# EAGLE design LEDController (EAGLE 7.1.0)
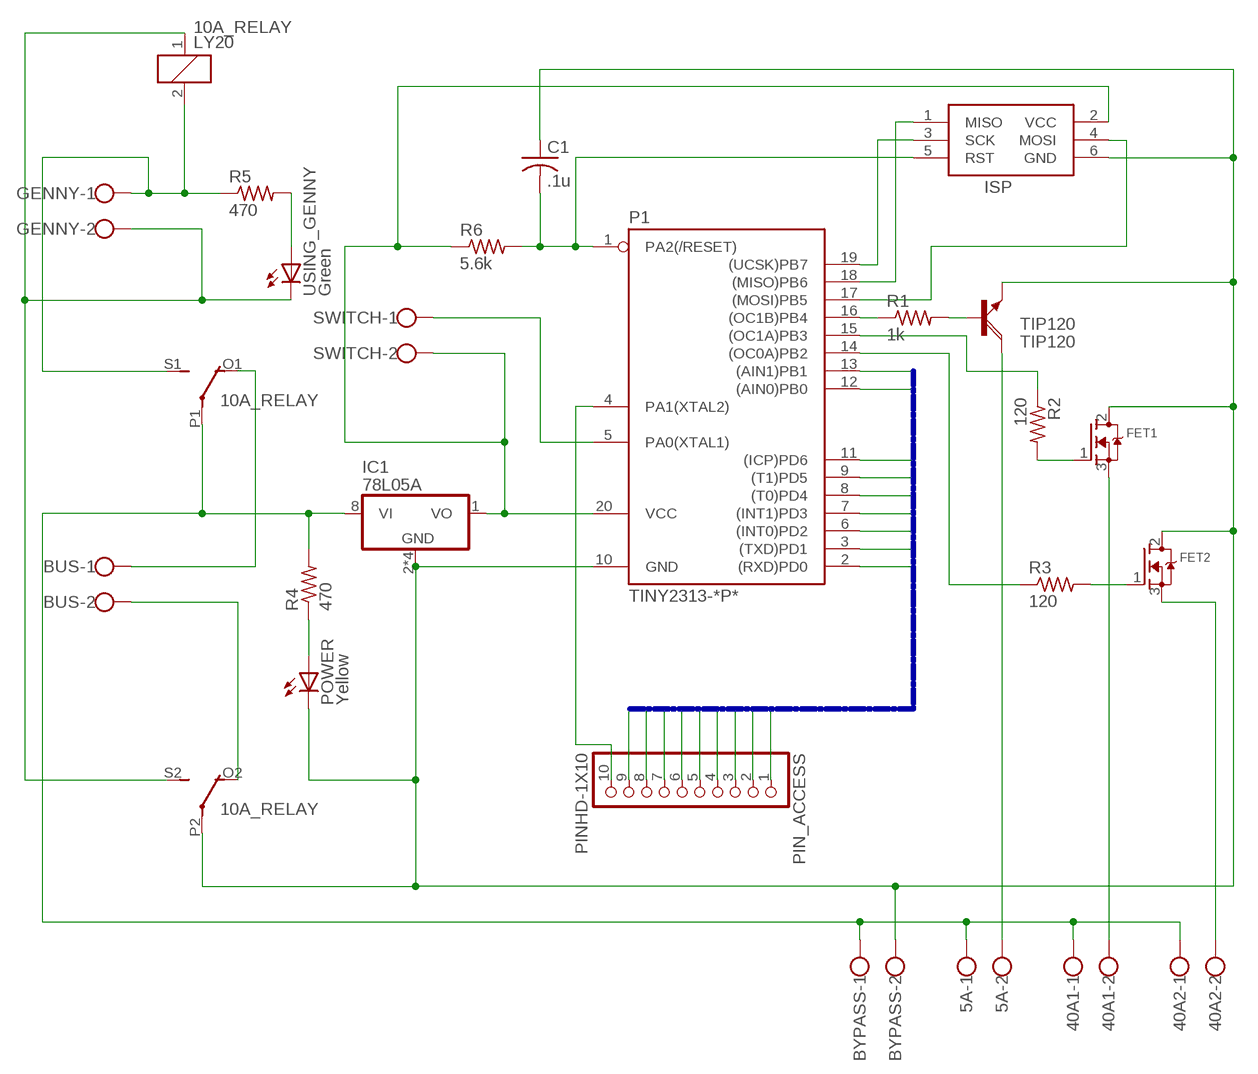
[diagram p0: schematic, sheet 1]

## Parts
5A  W237-102  [W237-102]
10A_RELAY  LY20  [LY20]
40A1  W237-102  [W237-102]
40A2  W237-102  [W237-102]
BUS  W237-102  [W237-102]
BYPASS  W237-102  [W237-102]
C1  .1u  C-US025-030X050  [C025-030X050]
FET1  MOSFET-NGDS_TO220V  [TO220V]
FET2  MOSFET-NGDS_TO220V  [TO220V]
GENNY  W237-102  [W237-102]
IC1  78L05A  [SOIC8]
ISP  AVRISP-6  [AVRISP]
P1  TINY2313-*P*  [DIL20]
PIN_ACCESS  PINHD-1X10  [1X10-BIG]
POWER  Yellow  LED5MM  [LED5MM]
R1  1k  R-US_0204/7  [0204/7]
R2  120  R-US_0204/7  [0204/7]
R3  120  R-US_0204/7  [0204/7]
R4  470  R-US_0204/7  [0204/7]
R5  470  R-US_0204/7  [0204/7]
R6  5.6k  R-US_0204/7  [0204/7]
SWITCH  W237-102  [W237-102]
TIP120  TIP120  [TO220AH]
USING_GENNY  Green  LED5MM  [LED5MM]

## Nets
10A_RELAY: 10A_RELAY.1 10A_RELAY.S2(3:S) GENNY.2 USING_GENNY.K(C)
GND: 10A_RELAY.P2(3:P) BYPASS.2 C1.1 FET1.2(D) FET2.2(D) IC1.2(GND) IC1.3(GND) IC1.6(GND) IC1.7(GND) ISP.6(GND) P1.10(GND) POWER.K(C) TIP120.E
N$1: ISP.1(MISO) P1.18((MISO)PB6)
N$2: P1.5(PA0(XTAL1)) SWITCH.1
N$3: P1.16((OC1B)PB4) R1.1
N$4: R1.2 TIP120.B
N$5: P1.15((OC1A)PB3) R2.1
N$6: FET1.1(G) R2.2
N$7: P1.14((OC0A)PB2) R3.1
N$8: FET2.1(G) R3.2
N$9: 5A.1 10A_RELAY.P1(2:P) 40A1.1 40A2.1 BYPASS.1 IC1.8(VI) R4.2
N$10: POWER.A R4.1
N$11: ISP.4(MOSI) P1.17((MOSI)PB5)
N$12: 10A_RELAY.2 10A_RELAY.S1(2:S) GENNY.1 R5.1
N$13: R5.2 USING_GENNY.A
N$15: 10A_RELAY.O1(2:O) BUS.1
N$16: 40A1.2 FET1.3(S)
N$17: 10A_RELAY.O2(3:O) BUS.2
N$18: 5A.2 TIP120.C
N$19: C1.2 ISP.5(RST) P1.1(PA2(/RESET)) R6.2
N$21: 40A2.2 FET2.3(S)
N$22: ISP.3(SCK) P1.19((UCSK)PB7)
N$23: P1.4(PA1(XTAL2)) PIN_ACCESS.10
PIN1: P1.2((RXD)PD0) PIN_ACCESS.1
PIN2: P1.3((TXD)PD1) PIN_ACCESS.2
PIN3: P1.12((AIN0)PB0) PIN_ACCESS.3
PIN4: P1.13((AIN1)PB1) PIN_ACCESS.4
PIN5: P1.6((INT0)PD2) PIN_ACCESS.5
PIN6: P1.7((INT1)PD3) PIN_ACCESS.6
PIN7: P1.8((T0)PD4) PIN_ACCESS.7
PIN8: P1.9((T1)PD5) PIN_ACCESS.8
PIN9: P1.11((ICP)PD6) PIN_ACCESS.9
VCC: IC1.1(VO) ISP.2(VCC) P1.20(VCC) R6.1 SWITCH.2

## Buses
PIN[1..9]

## Library data of the parts
5A 40A1 40A2 BUS BYPASS GENNY SWITCH = con-wago-500:W237-102: WAGO SCREW CLAMP; MPN: 237-102; OC_FARNELL: unknown; OC_NEWARK: 70K9898
10A_RELAY = relay:LY20: RELAY 2 x switch, Omron; OC_FARNELL: unknown; OC_NEWARK: unknown
C1 = adafruit:C-US: CAPACITOR, American symbol
FET1 FET2 = adafruit:MOSFET-N: N-Channel Mosfet 2N7002E - 60V 260mA SOT23 [Digikey: 2N7002ET1GOSTR-ND] - REEL BSH103 - 30V 850mA SOT23 [Digikey: 568-5013-1-ND]
IC1 = gm-regulators:78*: Positive VOLTAGE REGULATOR Source: http://cache.national.com/ds/LM/LM78L05.pdf http://www.fairchildsemi.com/ds/LM/LM7805.pdf
ISP = adafruit:AVRISP: AVR ISP HEADER Standard 6 pin header for AVR programming
P1 = avr-6:TINY2313*: Atmel Tiny2313 2K Flash, 128 bytes EEPROM, 128 bytes RAM
PIN_ACCESS = adafruit:PINHD-1X10: Pin header 1x10 0.1" spacing With round pins
POWER USING_GENNY = adafruit:LED: LED OSRAM: - CHIPLED LG R971, LG N971, LY N971, LG Q971, LY Q971, LO R971, LY R971 LH N974, LH R974 LS Q976, LO Q976, LY Q976 LO Q996 - Hyper CHIPLED LW Q18S LB Q993, LB Q99A, LB R99A - SideLED LS A670, LO A670, LY A670, LG A670, LP A670 LB A673, LV A673, LT A673, LW A673 LH A674 LY A675 LS A676, LA A676, LO A676, LY A676, LW A676 LS A679, LY A679, LG A679 - Hyper Micro SIDELED® LS Y876, LA Y876, LO Y876, LY Y876 LT Y87S - SmartLED LW L88C, LW L88S LB L89C, LB L89S, LG L890 LS L89K, LO L89K, LY L89K LS L896, LA L896, LO L896, LY L896 - TOPLED LS T670, LO T670, LY T670, LG T670, LP T670 LSG T670, LSP T670, LSY T670, LOP T670, LYG T670 LG T671, LOG T671, LSG T671 LB T673, LV T673, LT T673, LW T673 LH T674 LS T676, LA T676, LO T676, LY T676, LB T676, LH T676, LSB T676, LW T676 LB T67C, LV T67C, LT T67C, LS T67K, LO T67K, LY T67K, LW E67C LS E67B, LA E67B, LO E67B, LY E67B, LB E67C, LV E67C, LT E67C LW T67C LS T679, LY T679, LG T679 LS T770, LO T770, LY T770, LG T770, LP T770 LB T773, LV T773, LT T773, LW T773 LH T774 LS E675, LA E675, LY E675, LS T675 LS T776, LA T776, LO T776, LY T776, LB T776 LHGB T686 LT T68C, LB T68C - Hyper Mini TOPLED® LB M676 - Mini TOPLED Santana® LG M470 LS M47K, LO M47K, LY M47K Source: http://www.osram.convergy.de/
R1-R6 = adafruit:R-US_: RESISTOR, American symbol
TIP120 = transistor-power:TIP120: NPN DARLINGTON TRANSISTOR

## Board
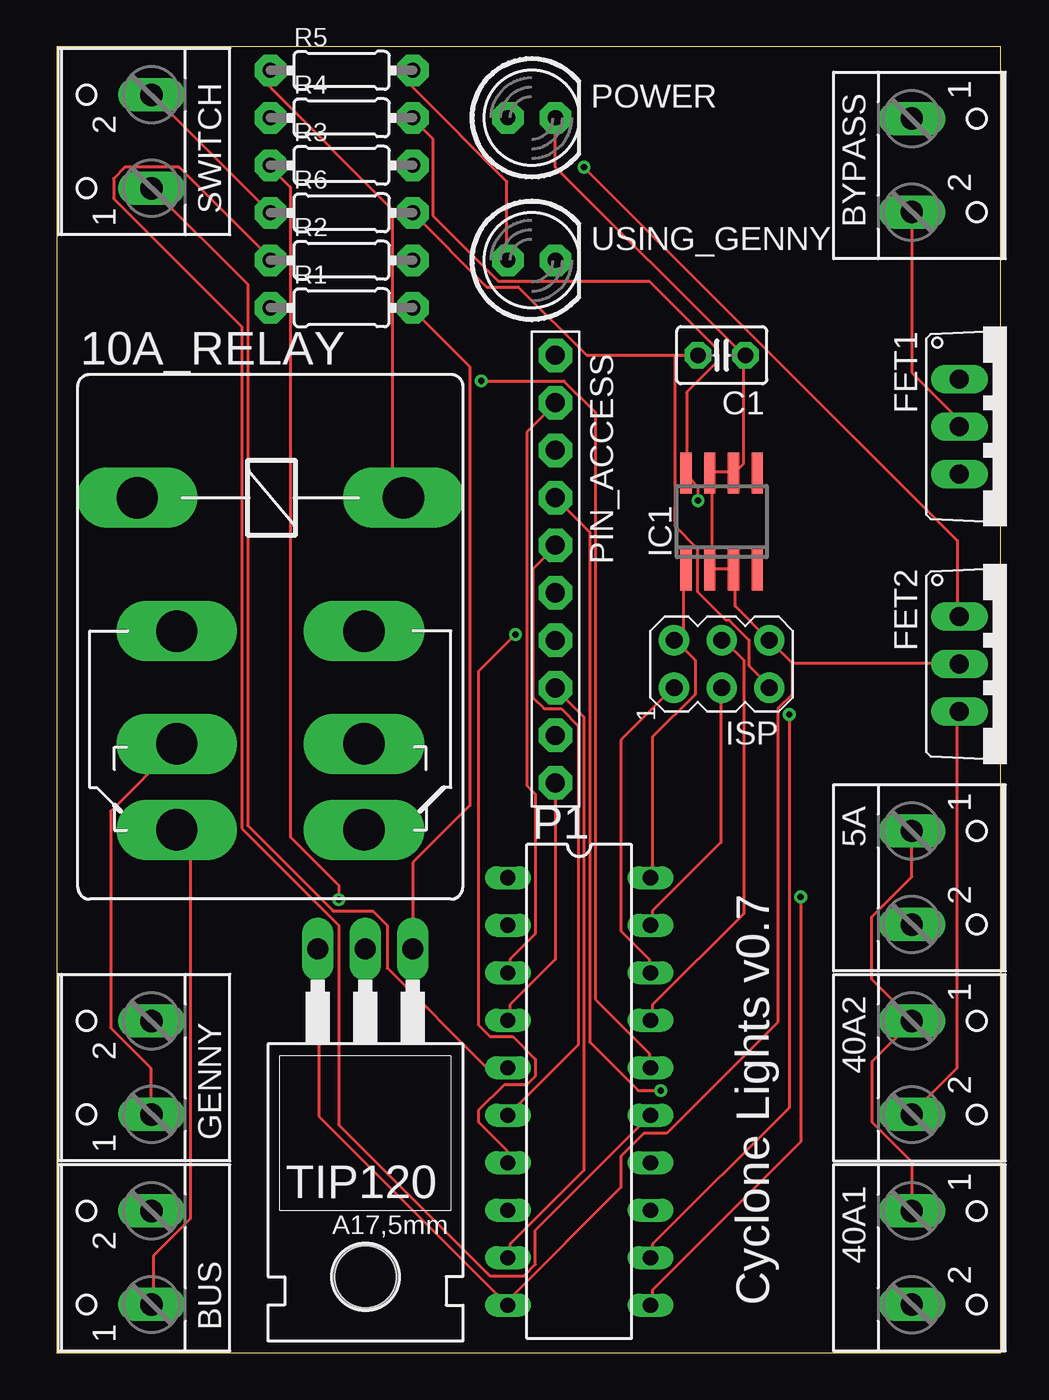
[diagram p1: board, top side]
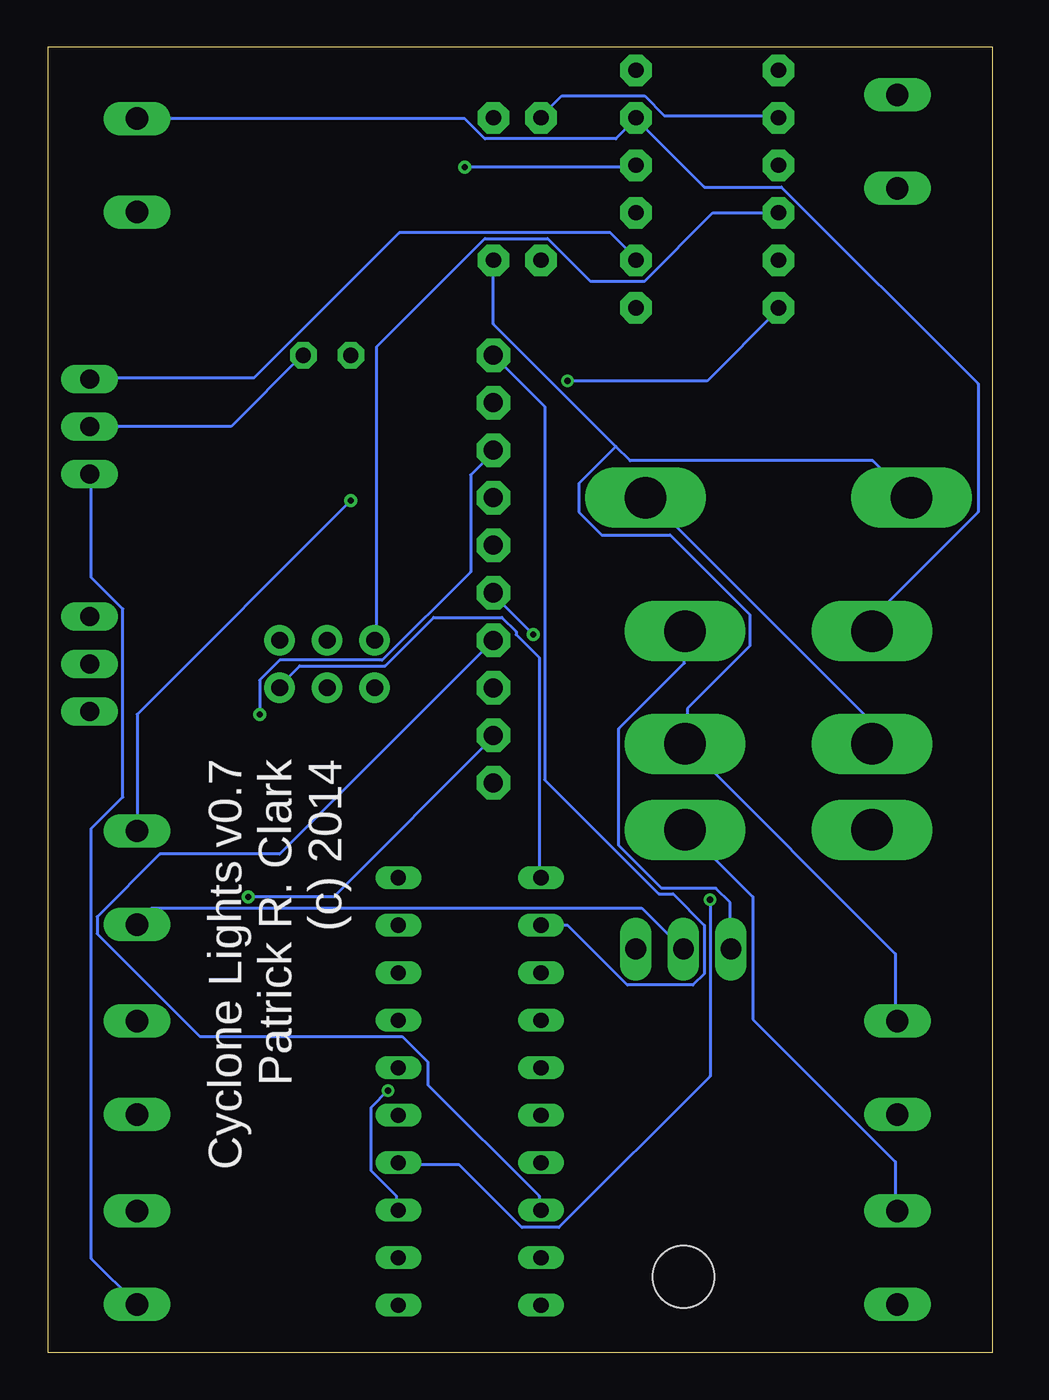
[diagram p2: board, bottom side, seen from below]

Size 50.47 x 69.84 mm. Coordinates in mm from the lower left corner, seen from the top.
Outline: 0,0 50.47,0 50.47,69.84 0,69.84 0,0
Copper layers (1*16): Top 0.0356mm / dielectric 1.5011mm / Bottom 0.0356mm
Design rules "LaenPCBOrder": minimum track width 6mil, minimum drill 13mil, track to track 6mil, track to pad 6mil, pad to pad 6mil, via to via 6mil, smd to smd 6mil, copper to edge 15mil, drill to drill 6mil, minimum pad ring 7mil, minimum via ring 7mil, stop-mask expansion 3mil, vias tented up to drill 0mil, thermal gap 10mil

### Footprints (pad centres in the part's own frame; a part is rotated, then mirrored left to right if it is on the bottom)
W237-102 = drill 1.194 long: 1 -2.5,-1.27; 2 2.5,-1.27
LY20 = drill 2.21 long: 1 -7.112,0; 2 7.112,0; O1 -5.004,-17.755; O2 5.004,-17.755; P1 -5.004,-7.137; P2 5.004,-7.137; S1 -5.004,-13.157; S2 5.004,-13.157
C025-030X050 = drill 0.813 pad 1.422 octagon: 1 -1.27,0; 2 1.27,0
TO220V = drill 1.016 long: 1 -2.54,-2.54; 2 0,-2.54; 3 2.54,-2.54
SOIC8 = smd 0.6 x 2.2: 1 -1.905,-2.6; 2 -0.635,-2.6; 3 0.635,-2.6; 4 1.905,-2.6; 5 1.905,2.6; 6 0.635,2.6; 7 -0.635,2.6; 8 -1.905,2.6
AVRISP = drill 0.9 pad 1.626: 1 -1.27,2.54; 2 1.27,2.54; 3 -1.27,0; 4 1.27,0; 5 -1.27,-2.54; 6 1.27,-2.54
DIL20 = drill 0.813 long: 1 -11.43,-3.81; 2 -8.89,-3.81; 3 -6.35,-3.81; 4 -3.81,-3.81; 5 -1.27,-3.81; 6 1.27,-3.81; 7 3.81,-3.81; 8 6.35,-3.81; 9 8.89,-3.81; 10 11.43,-3.81; 11 11.43,3.81; 12 8.89,3.81; 13 6.35,3.81; 14 3.81,3.81; 15 1.27,3.81; 16 -1.27,3.81; 17 -3.81,3.81; 18 -6.35,3.81; 19 -8.89,3.81; 20 -11.43,3.81
1X10-BIG = drill 1.016 pad 1.778 octagon: 1 -11.43,0; 2 -8.89,0; 3 -6.35,0; 4 -3.81,0; 5 -1.27,0; 6 1.27,0; 7 3.81,0; 8 6.35,0; 9 8.89,0; 10 11.43,0
LED5MM = drill 0.813 pad 1.676 octagon: A -1.27,0; K 1.27,0
0204/7 = drill 0.813 pad 1.676 octagon: 1 -3.81,0; 2 3.81,0
TO220AH = drill 1.118 long: B -2.54,-6.35; C 0,-6.35; E 2.54,-6.35 | hole 3.302: 0,11.176

### Placement (x,y rotation side)
5A  46.99,25.4 270 top
10A_RELAY  11.43,45.72 0 top
40A1  46.99,5.08 270 top
40A2  46.99,15.24 270 top
BUS  3.81,5.08 90 top
BYPASS  46.99,63.5 270 top
C1  35.56,53.34 180 top
FET1  50.8,49.53 270 top
FET2  50.8,36.83 270 top
GENNY  3.81,15.24 90 top
IC1  35.56,44.45 0 top
ISP  35.56,36.83 90 top
P1  27.94,13.97 270 top
PIN_ACCESS  26.67,41.91 270 top
POWER  25.4,66.04 0 top
R1  15.24,55.88 0 top
R2  15.24,58.42 0 top
R3  15.24,63.5 0 top
R4  15.24,66.04 0 top
R5  15.24,68.58 0 top
R6  15.24,60.96 0 top
SWITCH  3.81,64.77 90 top
TIP120  16.51,15.24 180 top
USING_GENNY  25.4,58.42 0 top

### Tracks (layer width: path | path; a pad name or v marks a point on that pad's centre or on a via)
10A_RELAY
  Bottom 0.152: GENNY.2 5.18,17.83 5.18,21.34 16.31,32.46 10A_RELAY.S2 16.31,32.61 16.31,34.44 12.95,37.8 12.95,39.47 17.22,43.74 20.88,43.74 22.1,44.96 22.1,46.48 20.12,48.46 | USING_GENNY.K 26.67,55.02 20.12,48.46 | 20.12,48.46 19.36,47.7 6.4,47.7 4.42,45.72 10A_RELAY.1
GND
  Top 0.152: TIP120.E 14.02,21.49 14.02,12.65 P1.10 24.23,2.59 24.23,2.9 30.18,8.84 30.18,10.52 31.39,11.73 32.61,11.73 38.56,17.68 38.56,34.44 39.32,35.2 39.32,36.88 | BYPASS.2 45.72,52.43 48.16,49.99 48.16,49.53 FET1.2 | 35.05,41.91 36.12,41.91 IC1.3 36.27,41.76 36.27,39.93 ISP.6 39.32,36.88 | 35.05,41.91 35.05,46.94 IC1.7 35.05,47.09 36.12,47.09 IC1.6 36.27,47.09 36.73,47.55 36.73,53.34 | 35.05,41.91 IC1.2 | 39.32,36.88 48.16,36.88 FET2.2 | POWER.K 26.67,63.4 36.73,53.34 | 36.73,53.34 C1.1
  Bottom 0.152: 10A_RELAY.P2 16.46,38.56 16.46,36.88 19.96,33.38 19.96,27.13 17.68,24.84 14.78,24.84 14.02,24.08 14.02,21.64 TIP120.E | FET1.2 40.69,49.53 36.88,53.34 C1.1
N$1
  Top 0.152: P1.18 31.7,20.42 31.7,21.03 30.18,22.55 30.18,32.77 32.92,35.51 ISP.1
N$2
  Top 0.152: P1.5 23.01,15.24 17.68,20.57 17.68,22.86 16.92,23.62 14.78,23.62 10.21,28.19 10.21,57.15 5.18,62.18 SWITCH.1
N$3  (via drill 0.33)
  Top 0.152: v22.71,51.97 27.13,51.97 28.8,50.29 28.8,18.9 31.7,16 31.7,15.24 P1.16
  Bottom 0.152: v22.71,51.97 15.24,51.97 11.43,55.78 R1.1
N$4
  Top 0.152: TIP120.B 19.05,26.21 22.1,29.26 22.1,52.73 19.05,55.78 R1.2
N$5
  Top 0.152: P1.15 25.6,6.55 25.6,4.72 24.99,4.12 23.16,4.12 15.09,12.19 15.09,22.86 9.91,28.04 9.91,54.86 3.05,61.72 3.05,62.79 3.66,63.4 6.55,63.4 11.43,58.52 R2.1
N$6
  Bottom 0.152: FET1.1 48.16,52.12 39.47,52.12 31.7,59.89 20.42,59.89 19.05,58.52 R2.2
N$7  (via drill 0.33)
  Top 0.152: v15.09,24.23 15.09,24.99 12.5,27.58 12.5,62.33 11.43,63.4 R3.1
  Bottom 0.152: v15.09,24.23 15.09,14.78 23.16,6.71 25.15,6.71 28.5,10.06 31.7,10.06 P1.14
N$8  (via drill 0.33)
  Top 0.152: v28.19,63.4 48.16,43.43 48.16,39.47 FET2.1
  Bottom 0.152: v28.19,63.4 19.05,63.4 R3.2
N$9  (via drill 0.33)
  Top 0.152: 40A1.1 45.72,10.21 43.59,12.34 43.59,15.54 45.72,17.68 40A2.1 45.72,17.83 43.59,19.96 43.59,23.32 45.72,25.45 5A.1 | R4.2 19.05,65.99 20.12,64.92 20.12,60.81 23.62,57.3 31.7,57.3 35.36,53.65 35.36,53.03 33.68,51.36 33.68,47.09 IC1.8 33.68,46.94 34.29,46.33 v34.29,45.57
  Bottom 0.152: 19.05,65.99 20.12,64.92 27.13,64.92 28.19,65.99 BYPASS.1 | 19.05,65.99 15.39,62.33 11.28,62.33 0.76,51.82 0.76,44.96 6.4,39.32 6.4,38.71 10A_RELAY.P1 | 19.05,65.99 R4.2 | 5A.1 45.72,34.14 v34.29,45.57
N$10
  Bottom 0.152: R4.1 11.43,66.14 17.53,66.14 18.59,67.21 23.01,67.21 24.08,66.14 POWER.A
N$11
  Top 0.152: P1.17 31.85,17.83 31.85,18.59 36.73,23.47 36.73,37.03 35.66,38.1 ISP.4
N$12
  Top 0.152: GENNY.1 5.03,12.8 5.03,15.24 2.9,17.37 2.9,28.96 6.4,32.46 10A_RELAY.S1 | R5.1 11.43,67.67 17.98,61.11 17.98,46.18 18.44,45.72 10A_RELAY.2
  Bottom 0.152: 10A_RELAY.S1 6.55,32.61 6.55,33.83 18.44,45.72 10A_RELAY.2
N$13
  Top 0.152: R5.2 19.05,67.67 24.08,62.64 24.08,58.52 USING_GENNY.A
N$15
  Top 0.152: BUS.1 5.18,2.59 5.18,5.18 7.16,7.16 7.16,27.28 6.55,27.89 10A_RELAY.O1
N$16
  Bottom 0.152: FET1.3 48.16,46.94 48.16,41.45 46.48,39.78 46.48,29.72 48.16,28.04 48.16,5.03 45.72,2.59 40A1.2
N$17
  Bottom 0.152: BUS.2 5.18,7.62 5.18,10.21 12.8,17.83 12.8,24.38 16.31,27.89 10A_RELAY.O2
N$18
  Bottom 0.152: TIP120.C 16.61,21.64 18.75,23.77 44.96,23.77 45.72,23.01 5A.2
N$19
  Top 0.152: 33.07,53.34 28.35,53.34 24.69,57 23.01,57 R6.2 | 33.07,53.34 C1.2 | 33.07,53.34 33.07,44.2 34.29,42.98 34.29,40.69 35.81,39.17 35.97,39.17 37.03,38.1 37.03,36.73 38.1,35.66 ISP.5
  Bottom 0.152: P1.1 24.23,25.45 24.23,37.19 25.45,38.41 25.45,38.56 26.21,39.32 29.87,39.32 32.46,36.73 37.03,36.73 38.1,35.66 ISP.5
N$21
  Top 0.152: FET2.3 48.16,34.29 48.16,15.24 45.72,12.8 40A2.2
N$22
  Top 0.152: P1.19 31.85,22.86 31.85,23.62 35.51,27.28 35.51,35.51 ISP.3
N$23
  Top 0.152: PIN_ACCESS.10 26.67,21.03 24.23,18.59 24.23,17.83 P1.4
PIN1
  Bottom 0.152: P1.2 22.71,22.86 19.51,19.66 16,19.66 15.39,20.27 15.39,22.86 17.07,24.54 17.83,24.54 23.93,30.63 23.93,50.6 PIN_ACCESS.1
PIN2
  Top 0.152: P1.3 24.23,20.42 24.23,21.03 25.6,22.4 25.6,29.87 25.15,30.33 25.15,49.23 26.67,50.75 PIN_ACCESS.2
PIN3  (via drill 0.33)
  Top 0.152: v39.17,34.14 39.17,13.11 31.85,5.79 31.85,5.18 P1.12
  Bottom 0.152: v39.17,34.14 39.17,35.97 38.1,37.03 32.61,37.03 27.89,41.76 27.89,46.94 26.67,48.16 PIN_ACCESS.3
PIN4  (via drill 0.33)
  Top 0.152: v32.31,14.02 31.09,14.02 28.5,16.61 28.5,43.89 PIN_ACCESS.4
  Bottom 0.152: v32.31,14.02 33.22,13.11 33.22,9.75 31.85,8.38 31.85,7.62 P1.13
PIN5
  Top 0.152: P1.6 27.89,16.46 27.89,33.53 26.98,34.44 26.06,34.44 25.45,35.05 25.45,41.91 26.67,43.13 PIN_ACCESS.5
PIN6  (via drill 0.33)
  Top 0.152: v24.54,38.41 22.55,36.42 22.55,17.53 23.16,16.92 24.38,16.92 25.6,15.7 25.6,14.78 25.15,14.33 23.93,14.33 22.55,12.95 22.55,12.34 24.08,10.82 24.08,10.21 P1.7
  Bottom 0.152: v24.54,38.41 26.67,40.54 PIN_ACCESS.6
PIN7
  Bottom 0.152: PIN_ACCESS.7 38.1,26.67 44.5,26.67 47.85,23.32 47.85,22.4 42.37,16.92 31.55,16.92 30.18,15.54 30.18,14.33 24.23,8.38 24.23,7.62 P1.8
PIN8
  Top 0.152: P1.9 24.23,5.18 24.23,5.79 28.19,9.75 28.19,33.98 26.67,35.51 PIN_ACCESS.8
PIN9  (via drill 0.33)
  Top 0.152: v39.78,24.38 39.78,11.28 31.85,3.35 31.85,2.59 P1.11
  Bottom 0.152: v39.78,24.38 35.2,24.38 26.67,32.92 PIN_ACCESS.9
VCC
  Top 0.152: R6.1 5.18,67.21 SWITCH.2 | 33.07,38.1 33.53,38.56 33.53,41.76 IC1.1 | 33.07,38.1 34.14,37.03 34.14,35.2 31.85,32.92 31.85,25.45 P1.20 | 33.07,38.1 ISP.2
  Bottom 0.152: R6.1 14.94,60.96 18.59,57.3 21.49,57.3 23.77,59.59 27.13,59.59 32.92,53.8 32.92,38.1 ISP.2

### Text on the board
_tsilk: Cyclone Lights v0.7
_bsilk: Cyclone Lights v0.7 / Patrick R. Clark / (c) 2014